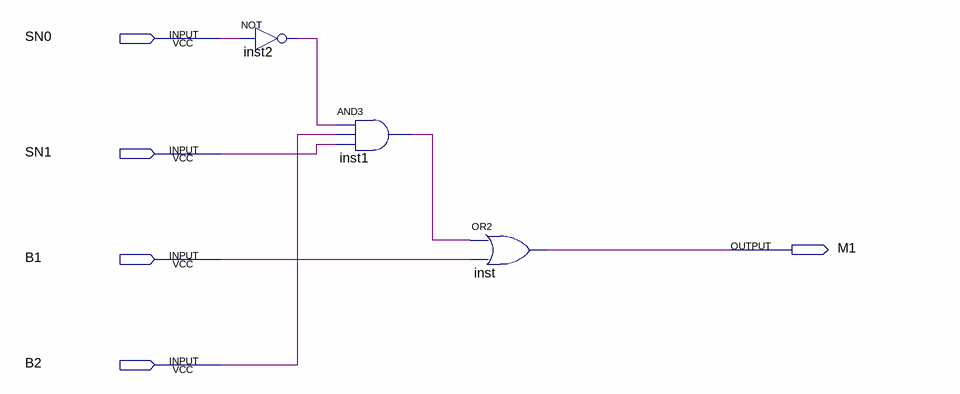
[diagram p0: schematic sheet]
// Quartus schematic ProjectA.bdf as structural Verilog: 3 symbols, 5 pins
module ProjectA (
  input  SN0,
  input  SN1,
  input  B1,
  input  B2,
  output M1
);

  wire inst1_out, inst2_out;

  not inst2 (inst2_out, SN0);
  and inst1 (inst1_out, inst2_out, B2, SN1);
  or inst (M1, inst1_out, B1);
endmodule
